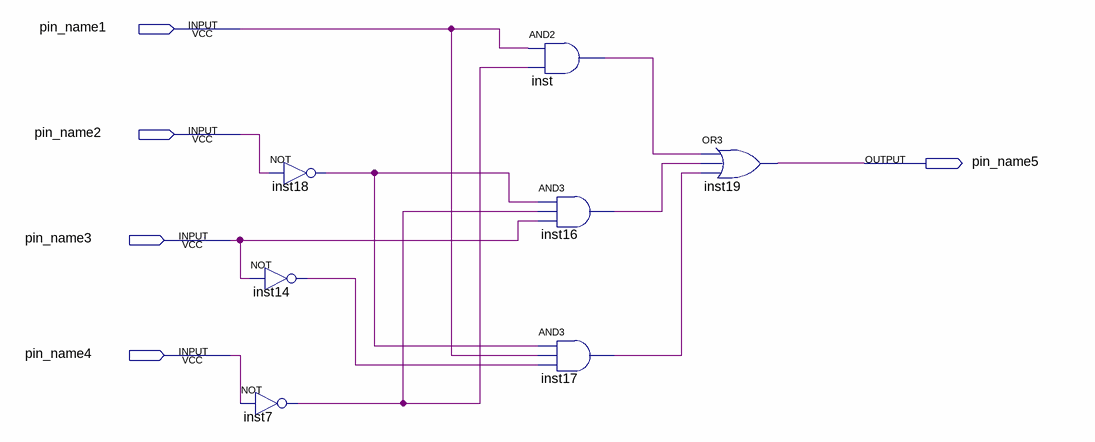
[diagram p0: schematic sheet]
// Quartus schematic e (2022_05_22 18_19_10 UTC).bdf as structural Verilog: 7 symbols, 5 pins
module \e_(2022_05_22_18_19_10_UTC)  (
  input  pin_name1,
  input  pin_name2,
  input  pin_name3,
  input  pin_name4,
  output pin_name5
);

  wire inst7_out, inst14_out, inst16_out, inst17_out, inst18_out, inst_out;

  not inst14 (inst14_out, pin_name3);
  not inst7 (inst7_out, pin_name4);
  not inst18 (inst18_out, pin_name2);
  and inst (inst_out, pin_name1, inst7_out);
  and inst16 (inst16_out, inst18_out, inst7_out, pin_name3);
  and inst17 (inst17_out, inst18_out, pin_name1, inst14_out);
  or inst19 (pin_name5, inst_out, inst16_out, inst17_out);
endmodule
